# Altium schematic sheet ppc_serial.SchDoc: PowerPC Serial Interfaces
size A3; Date: DO NOT USE, RATHER USE PROJ OPTIONS; DrawnBy: DO NOT USE, RATHER USE PROJ OPTIONS; Engineer: DO NOT USE, RATHER USE PROJ OPTIONS; Organization: DO NOT USE, RATHER USE PROJ OPTIONS; DocumentNumber: DO NOT USE, RATHER USE PROJ OPTIONS; Revision: DO NOT USE, RATHER USE PROJ OPTIONS; SheetNumber: 7; SheetTotal: 29; SCH_Sheet_Filename: ppc_serial.SchDoc; CurrentTime: DO NOT USE, RATHER USE PROJ OPTIONS; Time: DO NOT USE, RATHER USE PROJ OPTIONS; DocumentFullPathAndName: DO NOT USE, RATHER USE PROJ OPTIONS; DocumentName: DO NOT USE, RATHER USE PROJ OPTIONS; ModifiedDate: DO NOT USE, RATHER USE PROJ OPTIONS; ImagePath: DO NOT USE, RATHER USE PROJ OPTIONS
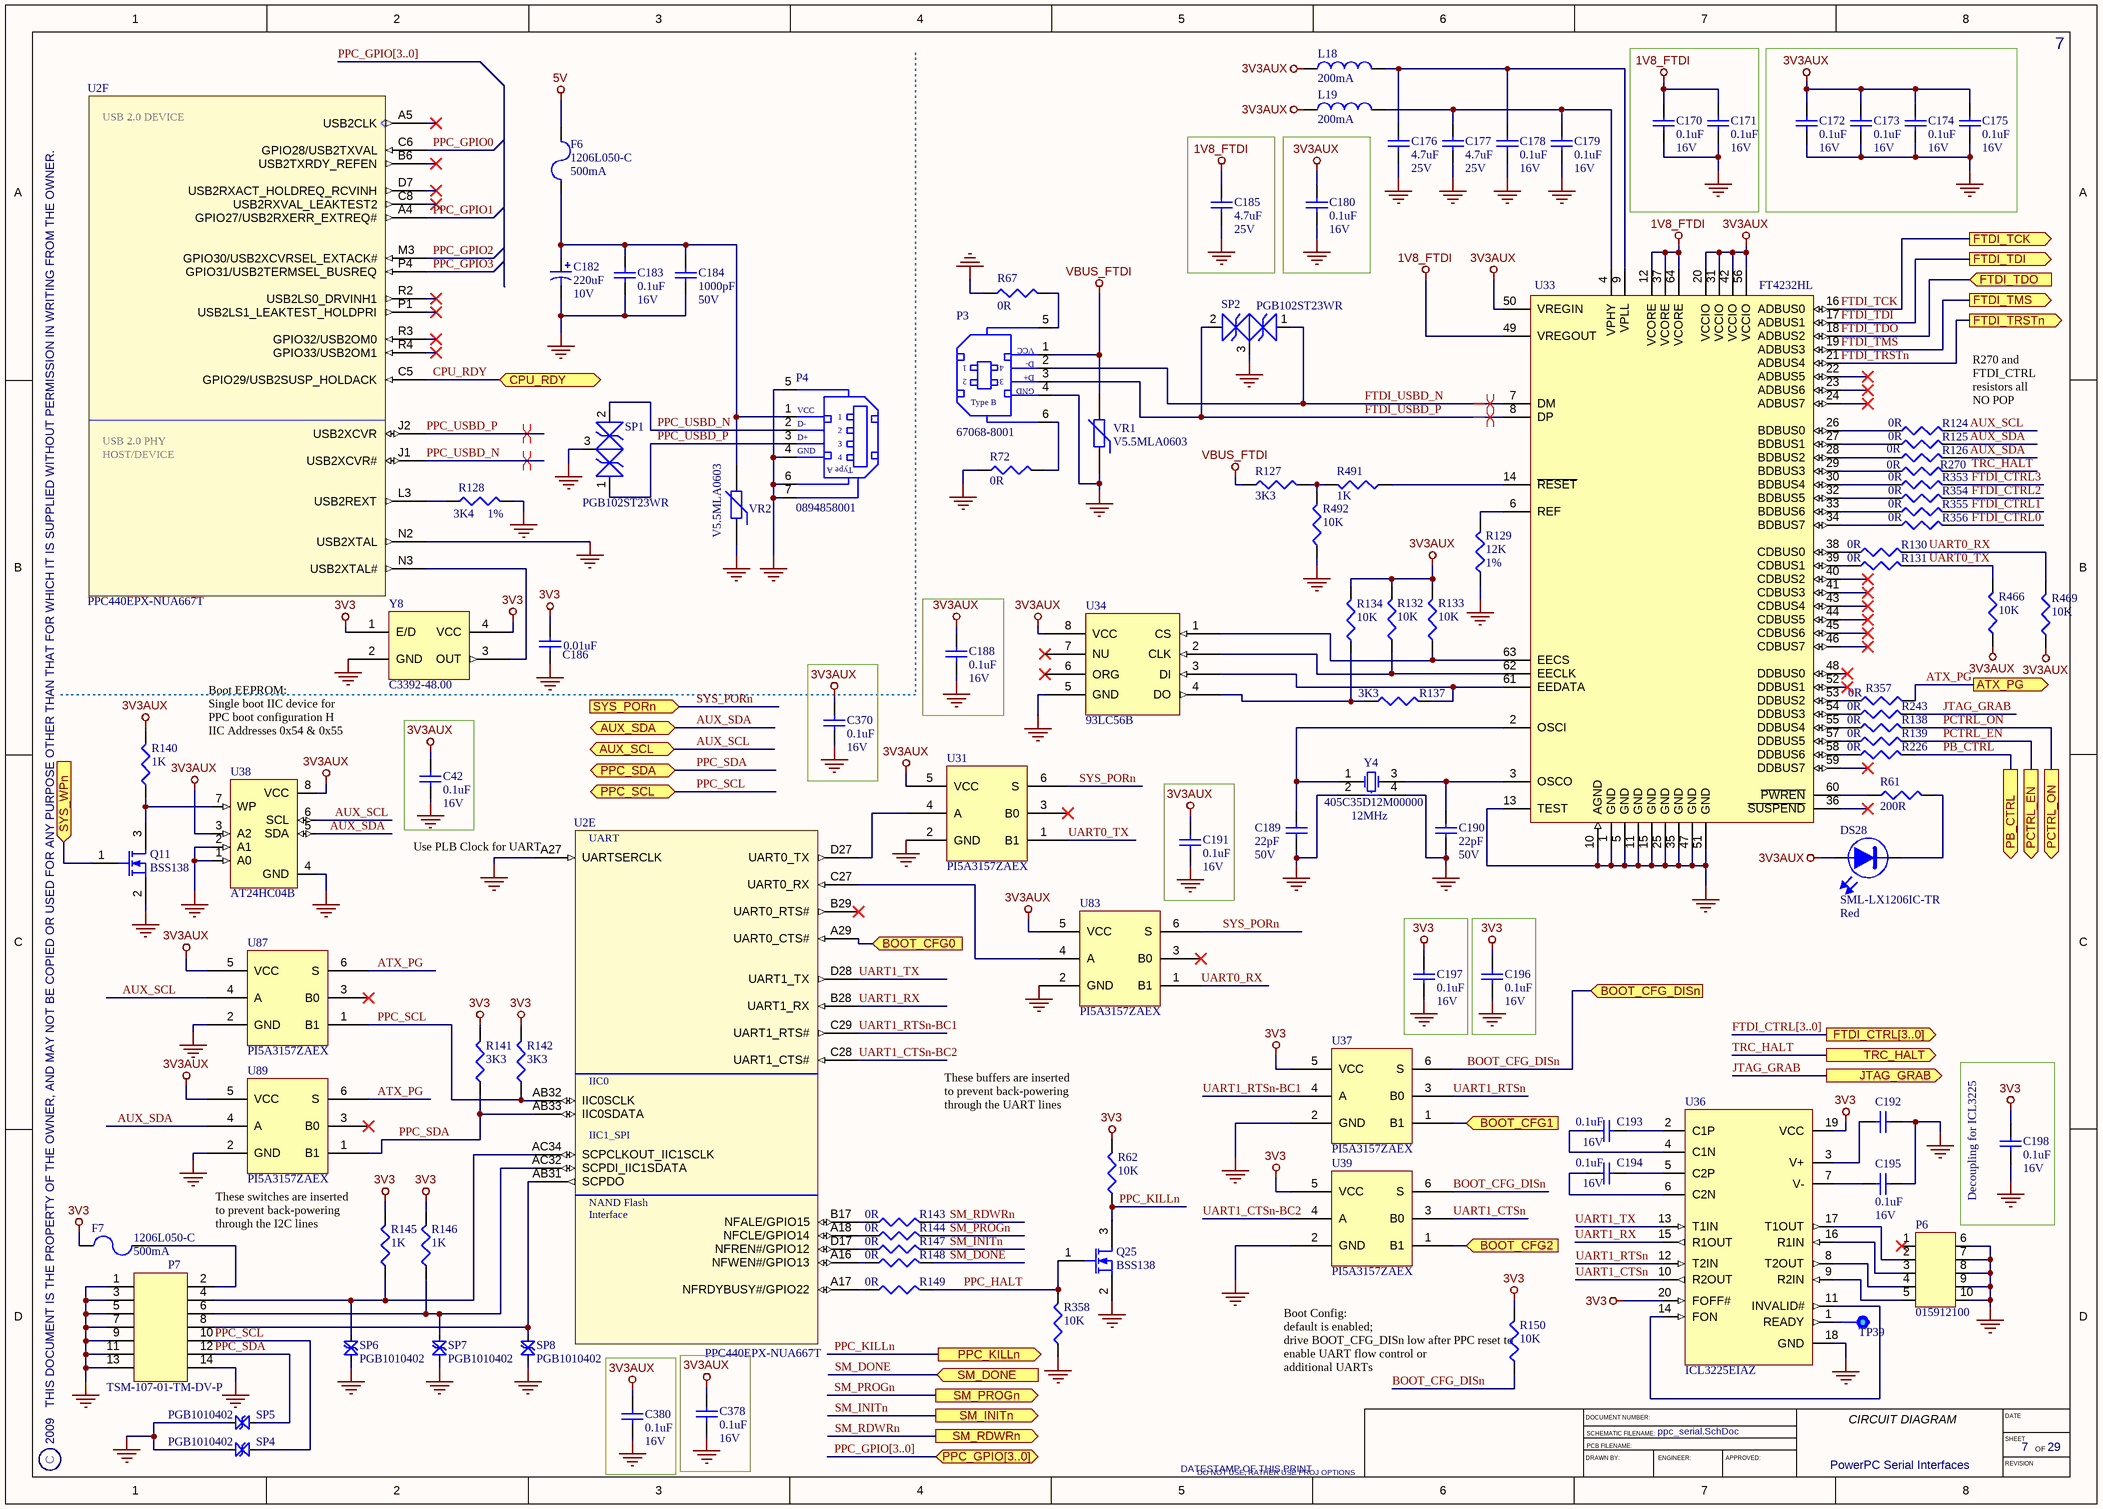
[diagram p0: ppc_serial.SchDoc]

## Parts
C42  Rating: 16V  [CAPC1005X60L]  (hidden comment: 0.1uF)
C170  Rating: 16V  [CAPC1005X60L]  (hidden comment: 0.1uF)
C171  Rating: 16V  [CAPC1005X60L]  (hidden comment: 0.1uF)
C172  Rating: 16V  [CAPC1005X60L]  (hidden comment: 0.1uF)
C173  Rating: 16V  [CAPC1005X60L]  (hidden comment: 0.1uF)
C174  Rating: 16V  [CAPC1005X60L]  (hidden comment: 0.1uF)
C175  Rating: 16V  [CAPC1005X60L]  (hidden comment: 0.1uF)
C176  Rating: 25V  [CAPC2012X127L]  (hidden comment: 4.7uF)
C177  Rating: 25V  [CAPC2012X127L]  (hidden comment: 4.7uF)
C178  Rating: 16V  [CAPC1005X60L]  (hidden comment: 0.1uF)
C179  Rating: 16V  [CAPC1005X60L]  (hidden comment: 0.1uF)
C180  Rating: 16V  [CAPC1005X60L]  (hidden comment: 0.1uF)
C182  Rating: 10V  [CAPMP7343X430L]  (hidden comment: 220uF)
C183  Rating: 16V  [CAPC1005X60L]  (hidden comment: 0.1uF)
C184  Rating: 50V  [CAPC1005X55L]  (hidden comment: 1000pF)
C185  Rating: 25V  [CAPC2012X127L]  (hidden comment: 4.7uF)
C186  0.01uF  [CAPC1005X55L]
C188  Rating: 16V  [CAPC1005X60L]  (hidden comment: 0.1uF)
C189  Rating: 50V  [CAPC1005X55L]  (hidden comment: 22pF)
C190  Rating: 50V  [CAPC1005X55L]  (hidden comment: 22pF)
C191  Rating: 16V  [CAPC1005X60L]  (hidden comment: 0.1uF)
C192  (no value)  [CAPC1005X60L]
C193  Rating: 16V  [CAPC1005X60L]  (hidden comment: 0.1uF)
C194  Rating: 16V  [CAPC1005X60L]  (hidden comment: 0.1uF)
C195  Rating: 16V  [CAPC1005X60L]  (hidden comment: 0.1uF)
C196  Rating: 16V  [CAPC1005X60L]  (hidden comment: 0.1uF)
C197  Rating: 16V  [CAPC1005X60L]  (hidden comment: 0.1uF)
C198  Rating: 16V  [CAPC1005X60L]  (hidden comment: 0.1uF)
C370  Rating: 16V  [CAPC1005X60L]  (hidden comment: 0.1uF)
C378  Rating: 16V  [CAPC1005X60L]  (hidden comment: 0.1uF)
C380  Rating: 16V  [CAPC1005X60L]  (hidden comment: 0.1uF)
DS28  SML-LX1206IC-TR  Colour: Red  [LEDC3216X120N]
F6  Rating: 500mA  [FUSMC3215X145]  (hidden comment: 1206L050-C)
F7  Rating: 500mA  [FUSMC3215X145]  (hidden comment: 1206L050-C)
L18  Rating: 200mA  [INDC2012X130L]  (hidden comment: 600R)
L19  Rating: 200mA  [INDC2012X130L]  (hidden comment: 600R)
P3  67068-8001  [MOLEX_67068-8001]
P4  USB_TYPEA_TYCO  [MOLEX_0894858001]  (value not drawn)
P6  015912100  [MOLEX_0015912100]
P7  TSM-107-01-TM-DV-P  [SAMTEC_TSM-107-01-TM-DV-P]
Q11  BSS138  [SOT95P245X110-3N]
Q25  BSS138  [SOT95P245X110-3N]
R61  200R  [RESC1005X40L]
R62  10K  [RESC1005X40L]
R67  0R  [RESC1005X40L]
R72  0R  [RESC1005X40L]
R124  0R  [RESC1005X40L]
R125  0R  [RESC1005X40L]
R126  0R  [RESC1005X40L]
R127  3K3  [RESC1005X40L]
R128  Tolerance: 1%  [RESC1005X40L]  (hidden comment: 3K4)
R129  Tolerance: 1%  [RESC1005X40L]  (hidden comment: 12K)
R130  0R  [RESC1005X40L]
R131  0R  [RESC1005X40L]
R132  10K  [RESC1005X40L]
R133  10K  [RESC1005X40L]
R134  10K  [RESC1005X40L]
R137  3K3  [RESC1005X40L]
R138  0R  [RESC1005X40L]
R139  0R  [RESC1005X40L]
R140  1K  [RESC1005X40L]
R141  3K3  [RESC1005X40L]
R142  3K3  [RESC1005X40L]
R143  0R  [RESC1005X40L]
R144  0R  [RESC1005X40L]
R145  1K  [RESC1005X40L]
R146  1K  [RESC1005X40L]
R147  0R  [RESC1005X40L]
R148  0R  [RESC1005X40L]
R149  0R  [RESC1005X40L]
R150  10K  [RESC1005X40L]
R226  0R  [RESC1005X40L]
R243  0R  [RESC1005X40L]
R270  0R  [RESC1005X40L]
R353  0R  [RESC1005X40L]
R354  0R  [RESC1005X40L]
R355  0R  [RESC1005X40L]
R356  0R  [RESC1005X40L]
R357  0R  [RESC1005X40L]
R358  10K  [RESC1005X40L]
R466  10K  [RESC1005X40L]
R469  10K  [RESC1005X40L]
R491  1K  [RESC1005X40L]
R492  10K  [RESC1005X40L]
SP1  PGB102ST23WR  [SOT95P245X110-3N]
SP2  PGB102ST23WR  [SOT95P245X110-3N]
SP4  PGB1010402  [PGB1010402]
SP5  PGB1010402  [PGB1010402]
SP6  PGB1010402  [PGB1010402]
SP7  PGB1010402  [PGB1010402]
SP8  PGB1010402  [PGB1010402]
TP39  Testpoint  [TP100]  (value not drawn)  (no BOM)
U2  PPC440EPX-NUA667T  [TE-PBGA680]  (parts E,F of 11)
U31  PI5A3157ZAEX  [SC70-6]
U33  FT4232HL  [QFN64]
U34  93LC56B  [SOIC150-8_N]
U36  ICL3225EIAZ  [SSOP20_M]
U37  PI5A3157ZAEX  [SC70-6]
U38  AT24HC04B  [TSSOP-8A2]
U39  PI5A3157ZAEX  [SC70-6]
U83  PI5A3157ZAEX  [SC70-6]
U87  PI5A3157ZAEX  [SC70-6]
U89  PI5A3157ZAEX  [SC70-6]
VR1  V5.5MLA0603  [VAR_V5_5MLA0603]
VR2  V5.5MLA0603  [VAR_V5_5MLA0603]
Y4  Frequency: 12MHz  [405XXXXXXMXXXXX]  (hidden comment: 405C35D12M00000)
Y8  C3392-48.00  [CB3X-X-XMX]

## Blocks framed on the sheet
Decoupling for ICL3225: C198

## Ports
ATX_PG (out), AUX_SCL (bidir), AUX_SDA (bidir), BOOT_CFG0 (in), BOOT_CFG1 (in), BOOT_CFG2 (in), BOOT_CFG_DISn (in), CPU_RDY (bidir), FTDI_CTRL[3..0] (out), FTDI_TCK (out), FTDI_TDI (out), FTDI_TDO (in), FTDI_TMS (out), FTDI_TRSTn (out), JTAG_GRAB (out), PB_CTRL (out), PCTRL_EN (out), PCTRL_ON (out), PPC_GPIO[3..0] (bidir), PPC_KILLn (out), PPC_SCL (bidir), PPC_SDA (bidir), SM_DONE (in), SM_INITn (out), SM_PROGn (out), SM_RDWRn (out), SYS_PORn (in), SYS_WPn (in), TRC_HALT (out)

## Nets
1V8_FTDI: C170.2 C171.2 C185.2 U33.12(VCORE) U33.37(VCORE) U33.49(VREGOUT) U33.64(VCORE)
3V3: C186.2 C196.2 C197.2 C198.2 F7.2 R62.2 R141.2 R142.2 R145.2 R146.2 R150.2 U36.19(VCC) U36.20(FOFF#) U37.5(VCC) U39.5(VCC) Y8.1(E/D) Y8.4(VCC)
3V3AUX: C42.2 C172.2 C173.2 C174.2 C175.2 C180.2 C188.2 C191.2 C370.2 C378.2 C380.2 DS28.2(A) L18.1 L19.1 R132.2 R133.2 R134.2 R140.2 R466.1 R469.1 U31.5(VCC) U33.20(VCCIO) U33.31(VCCIO) U33.42(VCCIO) U33.50(VREGIN) U33.56(VCCIO) U34.8(VCC) U38.3(A2) U38.8(VCC) U83.5(VCC) U87.5(VCC) U89.5(VCC)
5V: F6.2
GND: C42.1 C170.1 C171.1 C172.1 C173.1 C174.1 C175.1 C176.1 C177.1 C178.1 C179.1 C180.1 C182.2 C183.1 C184.1 C185.1 C186.1 C188.1 C189.1 C190.1 C191.1 C192.1 C195.1 C196.1 C197.1 C198.1 C370.1 C378.1 C380.1 P3.4 P4.4 P4.5 P4.6 P4.7 P6.6 P6.7 P6.8 P6.9 P6.10 P7.1 P7.3 P7.5 P7.7 P7.9 P7.11 P7.13 P7.14 Q11.2(S) Q25.2(S) R67.1 R72.1 R128.2 R129.1 R358.1 R492.1 SP1.3(COM) SP2.3(COM) SP4.2(B) SP5.2(B) SP6.1(A) SP7.1(A) SP8.1(A) U2.A27(UARTSERCLK) U2.N2(USB2XTAL) U31.2(GND) U33.1(GND) U33.5(GND) U33.10(AGND) U33.11(GND) U33.13(TEST) U33.15(GND) U33.25(GND) U33.35(GND) U33.47(GND) U33.51(GND) U34.5(GND) U36.18(GND) U37.2(GND) U38.1(A0) U38.2(A1) U38.4(GND) U39.2(GND) U83.2(GND) U87.2(GND) U89.2(GND) VR1.1 VR2.1 Y4.2 Y4.4 Y8.2(GND)
VBUS_FTDI: P3.1 R127.1 VR1.2
ATX_PG: R357.2 U87.6(S) U89.6(S) ; port ATX_PG
AUX_SCL: R124.2 U38.6(SCL) U87.4(A) ; port AUX_SCL
AUX_SDA: R125.2 R126.2 U38.5(SDA) U89.4(A) ; port AUX_SDA
BOOT_CFG0: U2.A29(UART0_CTS#) ; port BOOT_CFG0
BOOT_CFG1: U37.1(B1) ; port BOOT_CFG1
BOOT_CFG2: U39.1(B1) ; port BOOT_CFG2
BOOT_CFG_DISn: R150.1 U37.6(S) U39.6(S) ; port BOOT_CFG_DISn
CPU_RDY: U2.C5(GPIO29/USB2SUSP_HOLDACK) ; port CPU_RDY
FTDI_CTRL0: R356.2
FTDI_CTRL1: R355.2
FTDI_CTRL2: R354.2
FTDI_CTRL3: R353.2
FTDI_TCK: U33.16(ADBUS0) ; port FTDI_TCK
FTDI_TDI: U33.17(ADBUS1) ; port FTDI_TDI
FTDI_TDO: U33.18(ADBUS2) ; port FTDI_TDO
FTDI_TMS: U33.19(ADBUS3) ; port FTDI_TMS
FTDI_TRSTn: U33.21(ADBUS4) ; port FTDI_TRSTn
FTDI_USBD_N: P3.2 SP2.1(A) U33.7(DM)
FTDI_USBD_P: P3.3 SP2.2(B) U33.8(DP)
JTAG_GRAB: R243.2 ; port JTAG_GRAB
PB_CTRL: R226.2 ; port PB_CTRL
PCTRL_EN: R139.2 ; port PCTRL_EN
PCTRL_ON: R138.2 ; port PCTRL_ON
PPC_GPIO0: U2.C6(GPIO28/USB2TXVAL)
PPC_GPIO1: U2.A4(GPIO27/USB2RXERR_EXTREQ#)
PPC_GPIO2: U2.M3(GPIO30/USB2XCVRSEL_EXTACK#)
PPC_GPIO3: U2.P4(GPIO31/USB2TERMSEL_BUSREQ)
PPC_HALT: Q25.1(G) R149.2 R358.2
PPC_KILLn: Q25.3(D) R62.1 ; port PPC_KILLn
PPC_SCL: P7.10 R142.1 SP4.1(A) U2.AB32(IIC0SCLK) U87.1(B1) ; port PPC_SCL
PPC_SDA: P7.12 R141.1 SP5.1(A) U2.AB33(IIC0SDATA) U89.1(B1) ; port PPC_SDA
PPC_USBD_N: P4.2 SP1.2(B) U2.J1(USB2XCVR#)
PPC_USBD_P: P4.3 SP1.1(A) U2.J2(USB2XCVR)
SM_DONE: R148.2 ; port SM_DONE
SM_INITn: R147.2 ; port SM_INITn
SM_PROGn: R144.2 ; port SM_PROGn
SM_RDWRn: R143.2 ; port SM_RDWRn
SYS_PORn: U31.6(S) U83.6(S) ; port SYS_PORn
SYS_WPn: Q11.1(G) ; port SYS_WPn
TRC_HALT: R270.2 ; port TRC_HALT
UART0_RX: R130.2 R469.2 U83.1(B1)
UART0_TX: R131.2 R466.2 U31.1(B1)
UART1_CTSn: U36.10(R2OUT) U39.3(B0)
UART1_CTSn-BC2: U2.C28(UART1_CTS#) U39.4(A)
UART1_RTSn: U36.12(T2IN) U37.3(B0)
UART1_RTSn-BC1: U2.C29(UART1_RTS#) U37.4(A)
UART1_RX: U2.B28(UART1_RX) U36.15(R1OUT)
UART1_TX: U2.D28(UART1_TX) U36.13(T1IN)
NetC176_2: C176.2 C178.2 L18.2 U33.9(VPLL)
NetC177_2: C177.2 C179.2 L19.2 U33.4(VPHY)
NetC182_1: C182.1 C183.2 C184.2 F6.1 P4.1 VR2.2
NetC189_2: C189.2 U33.2(OSCI) Y4.1
NetC190_2: C190.2 U33.3(OSCO) Y4.3
NetC192_2: C192.2 U36.3(V+)
NetC193_1: C193.1 U36.2(C1P)
NetC193_2: C193.2 U36.4(C1N)
NetC194_1: C194.1 U36.5(C2P)
NetC194_2: C194.2 U36.6(C2N)
NetC195_2: C195.2 U36.7(V-)
NetDS28_1: DS28.1(K) R61.2
NetF7_1: F7.1 P7.2
NetP3_5: P3.5 R67.2
NetP3_6: P3.6 R72.2
NetP6_2: P6.2 U36.17(T1OUT)
NetP6_3: P6.3 U36.16(R1IN)
NetP6_4: P6.4 U36.8(T2OUT)
NetP6_5: P6.5 U36.9(R2IN)
NetP7_4: P7.4 R145.1 SP6.2(B) U2.AC34(SCPCLKOUT_IIC1SCLK)
NetP7_6: P7.6 R146.1 SP7.2(B) U2.AC32(SCPDI_IIC1SDATA)
NetP7_8: P7.8 SP8.2(B) U2.AB31(SCPDO)
NetQ11_3: Q11.3(D) R140.1 U38.7(WP)
NetR61_1: R61.1 U33.60(~{PWREN})
NetR124_1: R124.1 U33.26(BDBUS0)
NetR125_1: R125.1 U33.27(BDBUS1)
NetR126_1: R126.1 U33.28(BDBUS2)
NetR127_2: R127.2 R491.2 R492.2
NetR128_1: R128.1 U2.L3(USB2REXT)
NetR129_2: R129.2 U33.6(REF)
NetR130_1: R130.1 U33.38(CDBUS0)
NetR131_1: R131.1 U33.39(CDBUS1)
NetR132_1: R132.1 U33.62(EECLK) U34.2(CLK)
NetR133_1: R133.1 U33.63(EECS) U34.1(CS)
NetR134_1: R134.1 R137.1 U34.4(DO)
NetR137_2: R137.2 U33.61(EEDATA) U34.3(DI)
NetR138_1: R138.1 U33.55(DDBUS4)
NetR139_1: R139.1 U33.57(DDBUS5)
NetR143_1: R143.1 U2.B17(NFALE/GPIO15)
NetR144_1: R144.1 U2.A18(NFCLE/GPIO14)
NetR147_1: R147.1 U2.D17(NFREN#/GPIO12)
NetR148_1: R148.1 U2.A16(NFWEN#/GPIO13)
NetR149_1: R149.1 U2.A17(NFRDYBUSY#/GPIO22)
NetR226_1: R226.1 U33.58(DDBUS6)
NetR243_1: R243.1 U33.54(DDBUS3)
NetR270_1: R270.1 U33.29(BDBUS3)
NetR353_1: R353.1 U33.30(BDBUS4)
NetR354_1: R354.1 U33.32(BDBUS5)
NetR355_1: R355.1 U33.33(BDBUS6)
NetR356_1: R356.1 U33.34(BDBUS7)
NetR357_1: R357.1 U33.53(DDBUS2)
NetR491_1: R491.1 U33.14(~{RESET})
NetTP39_1: TP39.1 U36.1(READY)
NetU2_C27: U2.C27(UART0_RX) U83.4(A)
NetU2_D27: U2.D27(UART0_TX) U31.4(A)
NetU2_N3: U2.N3(USB2XTAL#) Y8.3(OUT)
NetU36_11: U36.11(INVALID#) U36.14(FON)

Not connected (* = marked no-connect by the designer): P6 1*; U2 A5(USB2CLK)* B6(USB2TXRDY_REFEN)* B29(UART0_RTS#)* C8(USB2RXVAL_LEAKTEST2)* D7(USB2RXACT_HOLDREQ_RCVINH)* P1(USB2LS1_LEAKTEST_HOLDPRI)* R2(USB2LS0_DRVINH1)* R3(GPIO32/USB2OM0)* R4(GPIO33/USB2OM1)*; U31 3(B0)*; U33 22(ADBUS5)* 23(ADBUS6)* 24(ADBUS7)* 36(~{SUSPEND})* 40(CDBUS2)* 41(CDBUS3)* 43(CDBUS4)* 44(CDBUS5)* 45(CDBUS6)* 46(CDBUS7)* 48(DDBUS0)* 52(DDBUS1)* 59(DDBUS7)*; U34 6(ORG)* 7(NU)*; U83 3(B0)*; U87 3(B0)*; U89 3(B0)*

## Buses and harness runs
bus FTDI_CTRL[3..0] = port FTDI_CTRL[3..0]
bus PPC_GPIO[3..0]
bus PPC_GPIO[3..0] = port PPC_GPIO[3..0]

## Layout directives
differential pair: FTDI_USBD_N, FTDI_USBD_P, PPC_USBD_N, PPC_USBD_P

## Notes on the sheet
- R270 and FTDI_CTRL resistors all NO POP
- Boot EEPROM:
  Single boot IIC device for
  PPC boot configuration H
  IIC Addresses 0x54 & 0x55
- (near U2) Use PLB Clock for UART
- (near R62) These buffers are inserted
  to prevent back-powering
  through the UART lines
- These switches are inserted
  to prevent back-powering
  through the I2C lines
- (near R150) Boot Config:
  default is enabled;
  drive BOOT_CFG_DISn low after PPC reset to
  enable UART flow control or
  additional UARTs
- 2009   THIS DOCUMENT IS THE PROPERTY OF THE OWNER, AND MAY NOT BE COPIED OR USED FOR ANY PURPOSE OTHER THAN THAT FOR WHICH IT IS SUPPLIED WITHOUT PERMISSION IN WRITING FROM THE OWNER.
- C
- DATESTAMP OF THIS PRINT
- DRAWN BY:
- DOCUMENT NUMBER:
- SCHEMATIC FILENAME:
- PCB FILENAME:
- ENGINEER:
- APPROVED:
- CIRCUIT DIAGRAM
- DATE
- SHEET
- REVISION
- OF
- (in symbol CONN-PCB-18) VCC; D-; D+; GND; Type A
- (in symbol CONN-PCB-25) VCC; D-; D+; GND; Type B
- (in symbol IC-CPU-1, part E) UART; IIC0; IIC1_SPI; NAND Flash; Interface
- (in symbol IC-CPU-1, part F) USB 2.0 DEVICE; USB 2.0 PHY; HOST/DEVICE

## Library data of the parts
C42 C170-C175 C178-C180 C183 C188 C191-C198 C370 C378 C380 = CAP-CER-1: 0.1uF, Ceramic Capacitor; Manufacturer: VENKEL; PartNum: C0402X7R160-104KN; Tolerance: 10%; Dielectric: X7R; POD number: CAP-CER-1; RoHS: Y; Sort Value: 0.1; Category: Capacitors; Subcategory: Ceramic
  C42 C170-C175 C178-C180 C183 C188 C191 C193-C198 C370 C378 C380: Value: 0.1uF
C176 C177 C185 = CAP-CER-3: 4.7uF, Ceramic Capacitor; Manufacturer: MURATA; PartNum: GRM21BR61E475KA12K; Tolerance: 10%; Dielectric: X5R; POD number: CAP-CER-3; Value: 4.7uF; RoHS: Y; Sort Value: 4.7; Category: Capacitors; Subcategory: Ceramic
C182 = CAP-TAN-0: 220uF, Solid Tantalum Chip Capacitor; Manufacturer: KEMET; PartNum: T491X227M010AT; Tolerance: 20%; ESR: 0.5; POD number: CAP-TAN-0; Value: 220uF; RoHS: Y; Sort Value: 220; Category: Capacitors; Subcategory: Tantalum
C184 = CAP-CER-4: 1000pF, Ceramic Capacitor; Manufacturer: MURATA; PartNum: GRM155R61H102KA01D; Tolerance: 10%; Dielectric: X5R; POD number: CAP-CER-4; Value: 1000pF; RoHS: Y; Sort Value: 0.0001; Category: Capacitors; Subcategory: Ceramic
C186 = CAP-CER-6: 0.01uF, Ceramic Capacitor; Manufacturer: MURATA; PartNum: GRM155R71E103KA01D; Tolerance: 10%; Rating: 25V; Dielectric: X7R; POD number: CAP-CER-6; RoHS: Y; Value: 0.01uF; Sort Value: 0.01; Category: Capacitors; Subcategory: Ceramic
C189 C190 = CAP-CER-2: 22pF, Ceramic Capacitor; Manufacturer: MURATA; PartNum: GRM1555C1H220JA01D; Tolerance: 5%; Dielectric: C0G; POD number: CAP-CER-2; Value: 22pF; RoHS: Y; Sort Value: 0.000022; Category: Capacitors; Subcategory: Ceramic
DS28 = OPTO-LED-1: Red, Surface mount, LED, 1206; Manufacturer: LUMEX; Vdrop: 2V; Rating: 20mA; POD number: OPTO-LED-1; PartNum: SML-LX1206IC-TR; RoHS: Y; Category: OPTO; Subcategory: LED
F6 F7 = ELMECH-FUSE-0: Resettable, Surface mount Fuse; Manufacturer: Littelfuse; POD number: ELMECH-FUSE-0; PartNum: 1206L050-C; RoHS: Y; Category: ELMECH; Subcategory: Fuses
L18 L19 = IND-FB-0: 600 Ohm, Chip Ferrite Bead; Manufacturer: Murata; PartNum: BLM21BD601SN1; DC Res: 0.35R; Tolerance: 25%; POD number: IND-FB-0; RoHS: Y; Value: 600R; Sort Value: 600; Category: Inductors; Subcategory: FerriteBead
P3 = CONN-PCB-25: Right angle, Through-hole, USB Type B Receptacle; Manufacturer: Molex; POD number: CONN-PCB-25; PartNum: 67068-8001; RoHS: Y; Category: CONN; Subcategory: PCB
P4 = CONN-PCB-18: Right angle, Through-hole, USB Type A Receptacle; POD number: CONN-PCB-18; PartNum: 0894858001
P6 = CONN-PCB-12: 2x5, 2.54 mm Pitch, Male Header; Manufacturer: Molex; POD number: CONN-PCB-12; PartNum: 015912100; RoHS: Y; Category: CONN; Subcategory: PCB
P7 = CONN-PCB-16: 2x7, 2.54 mm Pitch, Male Header; Manufacturer: SAMTEC; POD number: CONN-PCB-16; PartNum: TSM-107-01-TM-DV-P; RoHS: Y; Category: CONN; Subcategory: PCB
Q11 Q25 = TRANS-NFET-0: N-Channel Logic Level Enhancement Mode Field Effect Transistor; Manufacturer: Fairchild Semiconductor; Rating: 0.22A; POD number: TRANS-NFET-0; PartNum: BSS138; RoHS: Y; Category: TRANS; Subcategory: NFET
R61 = RES-TF-19: 200R, 1.1mm x 0.5mm, Thick Film Resistor; Manufacturer: ROYALOHM; PartNum: 0402WGF0201T1E; Tolerance: 1%; Rating: 0.0625W; POD number: RES-TF-19; Value: 200R; Sort Value: 200; Category: Resistors; Subcategory: ThickFilm; HelpURL: *.pdf
R62 R132-R134 R150 R358 R466 R469 R492 = RES-TF-5: 10K, 1.1mm x 0.5mm, Thick Film Resistor; Manufacturer: ROYALOHM; PartNum: 0402WGJ0103T1E; Tolerance: 5%; Rating: 0.0625W; POD number: RES-TF-5; Value: 10K; Sort Value: 10000; Category: Resistors; Subcategory: ThickFilm; HelpURL: *.pdf
R67 R72 R124-R126 R130 R131 R138 R139 R143 R144 R147-R149 R226 R243 R270 R353-R357 = RES-TF-0: 0R, 1.1mm x 0.5mm, Thick Film Resistor; Manufacturer: ROYALOHM; PartNum: 0402WG00000T1E; Tolerance: 0%; Rating: 0.0625W; POD number: RES-TF-0; Value: 0R; Sort Value: 0; Category: Resistors; Subcategory: ThickFilm
  R67 R72 R124-R126 R130 R131 R138 R139 R143 R144 R147-R149 R226 R243 R270 R353-R356: HelpURL: *.pdf
  R357: RoHS: Y; HelpURL: http://www.royalohm.com/pdf/general.pdf
R127 R137 R141 R142 = RES-TF-7: 3K3, 1.1mm x 0.5mm, Thick Film Resistor; Manufacturer: ROYALOHM; PartNum: 0402WGJ0332T1E; Tolerance: 5%; Rating: 0.0625W; POD number: RES-TF-7; Value: 3K3; Sort Value: 3300; Category: Resistors; Subcategory: ThickFilm
  R127 R137: HelpURL: *.pdf
  R141 R142: RoHS: Y; HelpURL: http://www.royalohm.com/pdf/general.pdf
R128 = RES-TF-2: 3K4, 1.1mm x 0.5mm, Thick Film Resistor; Manufacturer: ROYALOHM; PartNum: 0402WGF0342T1E; Rating: 0.0625W; POD number: RES-TF-2; Value: 3K4; Sort Value: 3400; Category: Resistors; Subcategory: ThickFilm; HelpURL: *.pdf
R129 = RES-TF-3: 12K, 1.1mm x 0.5mm, Thick Film Resistor; Manufacturer: ROYALOHM; PartNum: 0402WGF0123T1E; Rating: 0.0625W; POD number: RES-TF-3; Value: 12K; Sort Value: 12000; Category: Resistors; Subcategory: ThickFilm; HelpURL: *.pdf
R140 R145 R146 R491 = RES-TF-8: 1K, 1.1mm x 0.5mm, Thick Film Resistor; Manufacturer: ROYALOHM; PartNum: 0402WGJ0102T1E; Tolerance: 5%; Rating: 0.0625W; POD number: RES-TF-8; Value: 1K; Sort Value: 1000; Category: Resistors; Subcategory: ThickFilm; HelpURL: *.pdf
SP1 SP2 = ELMECH-ESD-4: Ultra-low Capacitance, Surface mount ESD Suppressor; Manufacturer: Littelfuse; POD number: ELMECH-ESD-4; PartNum: PGB102ST23WR; RoHS: Y; Category: ELMECH; Subcategory: ESD Suppressors
SP4-SP8 = ELMECH-ESD-3: Surface Mount Polymeric ESD Suppressor in an 0402 package; POD number: ELMECH-ESD-3; PartNum: PGB1010402
TP39 = ELMECH-TP-0: 1mm Diameter, through-hole, Circular Test-point; POD number: ELMECH-TP-0; RoHS: Y; Category: ELMECH; Subcategory: Test Points
U2 = IC-CPU-1: 667MHz, non-RoHS, PPC440EPx uProcessor; Manufacturer: Applied Micro; POD number: IC-CPU-1; PartNum: PPC440EPX-NUA667T; RoHS: Y; Category: IC; Subcategory: CPU
U31 U37 U39 U83 U87 U89 = IC-LOG-5: Low voltage SPDT Analogue Switch; Manufacturer: PERICOM; POD number: IC-LOG-5; PartNum: PI5A3157ZAEX; RoHS: Y; Category: IC; Subcategory: Logic
U33 = IC-IF-0: Quad High Speed USB to Multipurpose UART/MPSSE; Manufacturer: FTDI; POD number: IC-IF-0; PartNum: FT4232HL; RoHS: Y; Category: IC; Subcategory: Interface
U34 = IC-MEM-3: 2K Microwire Compatible Serial EEPROM; Manufacturer: Microchip; PartNum: 93LC56B/SN; POD number: IC-MEM-3; RoHS: Y; Category: IC; Subcategory: Memory
U36 = IC-LOG-9: Low-power RS232 transceivers; Manufacturer: Intersil; POD number: IC-LOG-9; PartNum: ICL3225EIAZ; RoHS: Y; Category: IC; Subcategory: Logic
U38 = IC-MEM-4: 4K Serial EEPROM; Manufacturer: Atmel; POD number: IC-MEM-4; PartNum: AT24HC04B; RoHS: Y; Category: IC; Subcategory: Memory
VR1 VR2 = ELMECH-ESD-2: Multilayer Transient Voltage Surge Suppressing Varistor; Manufacturer: Littelfuse; POD number: ELMECH-ESD-2; PartNum: V5.5MLA0603; RoHS: Y; Category: ELMECH; Subcategory: ESD Suppressors
Y4 = RESN-XTAL-4: 12 MHz, Surface mount, Crystal Oscillator; Manufacturer: CTS; Stability: 50 PPM; Load Capacitance: 18 pF; POD number: RESN-XTAL-4; PartNum: 405C35D12M00000; RoHS: Y; Category: RESN; Subcategory: Crystal Oscillator
Y8 = RESN-CLK-7: 48 MHz, 3V3, Surface mount, Clock Oscillator; Manufacturer: Crystek; Frequency: 48MHz; Stability: 50 PPM; POD number: RESN-CLK-7; PartNum: C3392-48.00; RoHS: Y; Category: RESN; Subcategory: Clock Oscillators